# EAGLE design house rev2 (EAGLE 7.2.0)
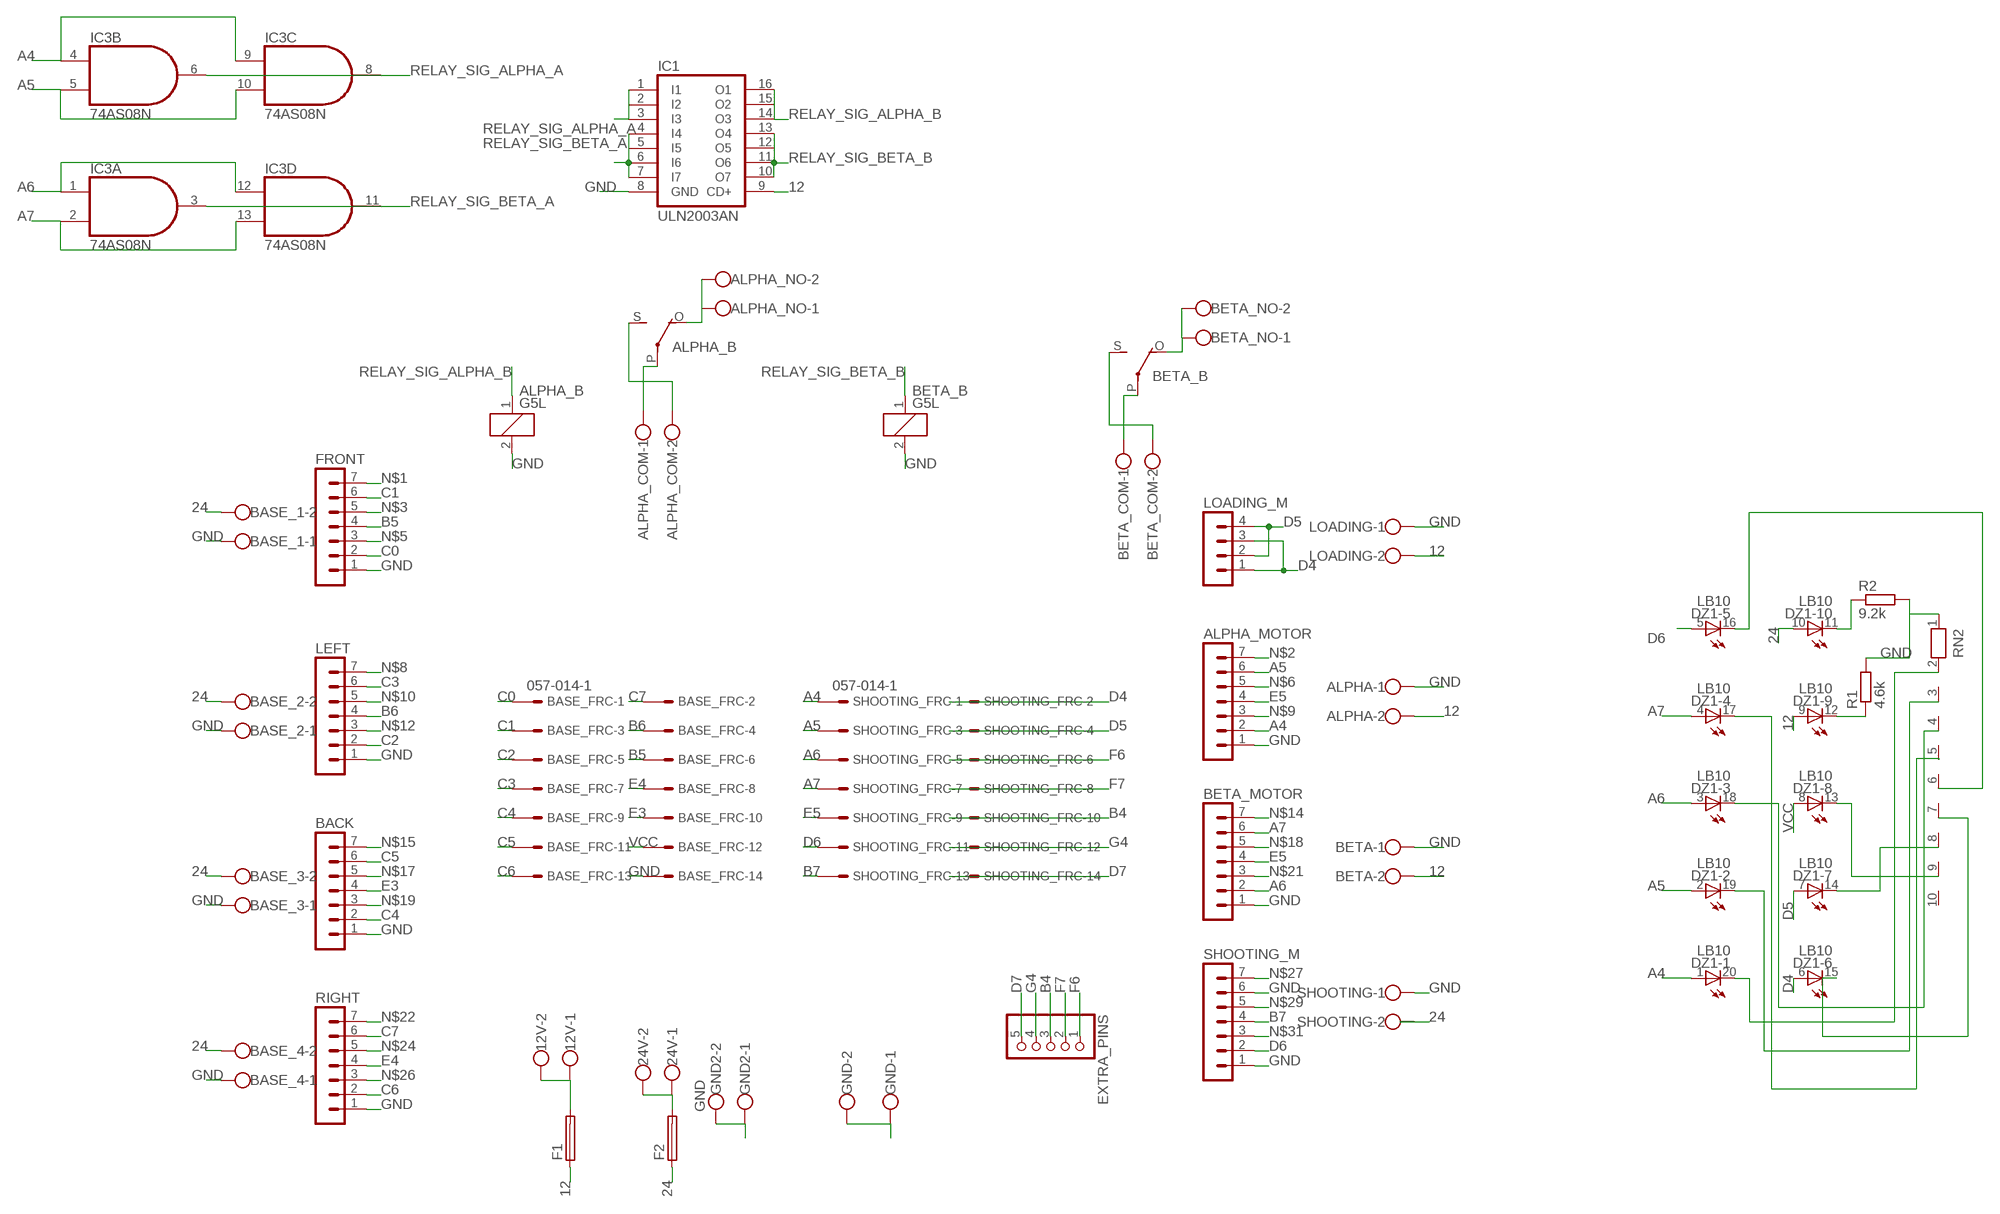
[diagram p0: schematic, sheet 1]

## Parts
12V  W237-102  [W237-102]
24V  W237-102  [W237-102]
ALPHA  W237-102  [W237-102]
ALPHA_B  G5L  [G5LE]
ALPHA_COM  W237-102  [W237-102]
ALPHA_MOTOR  MA07-1  [MA07-1]
ALPHA_NO  W237-102  [W237-102]
BACK  MA07-1  [MA07-1]
BASE_1  W237-102  [W237-102]
BASE_2  W237-102  [W237-102]
BASE_3  W237-102  [W237-102]
BASE_4  W237-102  [W237-102]
BASE_FRC  057-014-1  [057-014-1]
BETA  W237-102  [W237-102]
BETA_B  G5L  [G5LE]
BETA_COM  W237-102  [W237-102]
BETA_MOTOR  MA07-1  [MA07-1]
BETA_NO  W237-102  [W237-102]
DZ1  LB10  [LB10]
EXTRA_PINS  PINHD-1X5  [1X05]
F1  SH25  [SH25]
F2  SH25  [SH25]
FRONT  MA07-1  [MA07-1]
GND  W237-102  [W237-102]
GND2  GND  W237-102  [W237-102]
IC1  ULN2003AN  [DIL16]
IC3  74AS08N  [DIL14]
LEFT  MA07-1  [MA07-1]
LOADING  W237-102  [W237-102]
LOADING_M  MA04-1  [MA04-1]
R1  4.6k  R-EU_0204/7  [0204/7]
R2  9.2k  R-EU_0204/7  [0204/7]
RIGHT  MA07-1  [MA07-1]
RN2  RN09  [RN-10]
SHOOTING  W237-102  [W237-102]
SHOOTING_FRC  057-014-1  [057-014-1]
SHOOTING_M  MA07-1  [MA07-1]

## Nets
12: ALPHA.2 BETA.2 DZ1.9(-9:A) F1.1 IC1.9(CD+) LOADING.2
24: BASE_1.2 BASE_2.2 BASE_3.2 BASE_4.2 DZ1.10(-10:A) F2.1 SHOOTING.2
A4: ALPHA_MOTOR.2 DZ1.1(-1:A) IC3.4(B:I0) IC3.9(C:I0) SHOOTING_FRC.1
A5: ALPHA_MOTOR.6 DZ1.2(-2:A) IC3.5(B:I1) IC3.10(C:I1) SHOOTING_FRC.3
A6: BETA_MOTOR.2 DZ1.3(-3:A) IC3.1(A:I0) IC3.12(D:I0) SHOOTING_FRC.5
A7: BETA_MOTOR.6 DZ1.4(-4:A) IC3.2(A:I1) IC3.13(D:I1) SHOOTING_FRC.7
B4: EXTRA_PINS.3 SHOOTING_FRC.10
B5: BASE_FRC.6 FRONT.4
B6: BASE_FRC.4 LEFT.4
B7: SHOOTING_FRC.13 SHOOTING_M.4
C0: BASE_FRC.1 FRONT.2
C1: BASE_FRC.3 FRONT.6
C2: BASE_FRC.5 LEFT.2
C3: BASE_FRC.7 LEFT.6
C4: BACK.2 BASE_FRC.9
C5: BACK.6 BASE_FRC.11
C6: BASE_FRC.13 RIGHT.2
C7: BASE_FRC.2 RIGHT.6
D4: DZ1.6(-6:A) LOADING_M.1 LOADING_M.3 SHOOTING_FRC.2
D5: DZ1.7(-7:A) LOADING_M.2 LOADING_M.4 SHOOTING_FRC.4
D6: DZ1.5(-5:A) SHOOTING_FRC.11 SHOOTING_M.2
D7: EXTRA_PINS.5 SHOOTING_FRC.14
E3: BACK.4 BASE_FRC.10
E4: BASE_FRC.8 RIGHT.4
E5: ALPHA_MOTOR.4 BETA_MOTOR.4 SHOOTING_FRC.9
F6: EXTRA_PINS.1 SHOOTING_FRC.6
F7: EXTRA_PINS.2 SHOOTING_FRC.8
G4: EXTRA_PINS.4 SHOOTING_FRC.12
GND: ALPHA.1 ALPHA_B.2 ALPHA_MOTOR.1 BACK.1 BASE_1.1 BASE_2.1 BASE_3.1 BASE_4.1 BASE_FRC.14 BETA.1 BETA_B.2 BETA_MOTOR.1 FRONT.1 GND2.1 GND2.2 GND.1 GND.2 IC1.8(GND) LEFT.1 LOADING.1 R1.2 R2.2 RIGHT.1 RN2.1 SHOOTING.1 SHOOTING_M.1 SHOOTING_M.6
N$1: FRONT.7
N$2: ALPHA_MOTOR.7
N$3: FRONT.5
N$4: DZ1.20(-1:C) RN2.2
N$5: FRONT.3
N$6: ALPHA_MOTOR.5
N$7: DZ1.19(-2:C) RN2.3
N$8: LEFT.7
N$9: ALPHA_MOTOR.3
N$10: LEFT.5
N$11: DZ1.18(-3:C) RN2.4
N$12: LEFT.3
N$13: DZ1.17(-4:C) RN2.5
N$14: BETA_MOTOR.7
N$15: BACK.7
N$16: DZ1.16(-5:C) RN2.6
N$17: BACK.5
N$18: BETA_MOTOR.5
N$19: BACK.3
N$20: DZ1.15(-6:C) RN2.7
N$21: BETA_MOTOR.3
N$22: RIGHT.7
N$23: BETA_B.P(2:P) BETA_COM.1
N$24: RIGHT.5
N$25: DZ1.14(-7:C) RN2.8
N$26: RIGHT.3
N$27: SHOOTING_M.7
N$28: DZ1.13(-8:C) RN2.9
N$29: SHOOTING_M.5
N$30: DZ1.12(-9:C) R1.1
N$31: SHOOTING_M.3
N$32: DZ1.11(-10:C) R2.1
N$33: BETA_B.S(2:S) BETA_COM.2
N$34: ALPHA_B.S(2:S) ALPHA_COM.2
N$35: ALPHA_B.P(2:P) ALPHA_COM.1
N$36: ALPHA_B.O(2:O) ALPHA_NO.1 ALPHA_NO.2
N$37: BETA_B.O(2:O) BETA_NO.1 BETA_NO.2
N$38: 24V.1 24V.2 F2.2
N$39: 12V.1 12V.2 F1.2
RELAY_SIG_ALPHA_A: IC1.1(I1) IC1.2(I2) IC1.3(I3) IC3.6(B:O) IC3.8(C:O)
RELAY_SIG_ALPHA_B: ALPHA_B.1 IC1.14(O3) IC1.15(O2) IC1.16(O1)
RELAY_SIG_BETA_A: IC1.4(I4) IC1.5(I5) IC1.6(I6) IC1.7(I7) IC3.3(A:O) IC3.11(D:O)
RELAY_SIG_BETA_B: BETA_B.1 IC1.10(O7) IC1.11(O6) IC1.12(O5) IC1.13(O4)
VCC: BASE_FRC.12 DZ1.8(-8:A)
Unconnected: RN2.10

## Power pins joined to a net without a drawn wire
GND: IC3.7(P:GND)
VCC: IC3.14(P:VCC)

## Library data of the parts
12V 24V ALPHA ALPHA_COM ALPHA_NO BASE_1-BASE_4 BETA BETA_COM BETA_NO GND GND2 LOADING SHOOTING = con-wago-500:W237-102: WAGO SCREW CLAMP; MPN: 237-102; OC_FARNELL: unknown; OC_NEWARK: 70K9898
ALPHA_B BETA_B = relay:G5L: RELAY 1 x switch, 10 A/120 V AC, 8 A/30 V ADC, Omron; OC_FARNELL: unknown; OC_NEWARK: unknown
ALPHA_MOTOR BACK BETA_MOTOR FRONT LEFT RIGHT SHOOTING_M = con-lstb:MA07-1: PIN HEADER; OC_FARNELL: unknown; OC_NEWARK: unknown
BASE_FRC SHOOTING_FRC = con-panduit:057-014-: CONNECTOR 10-pin series 057 contact pc board low profile headers; OC_FARNELL: unknown; OC_NEWARK: unknown
DZ1 = led:LB10: LED BLOCK 10-LED bar graph, DIL, Siemens
EXTRA_PINS = pinhead:PINHD-1X5: PIN HEADER
F1 F2 = fuse:SH25: FUSE HOLDER grid 25 mm, OGN0031 8211, Schurter (Buerklin); MF: SCHURTER; MPN: 0031.8211; OC_FARNELL: 1162741; OC_NEWARK: 96B9380
IC1 = uln-udn:ULN2003A: DRIVER ARRAY
IC3 = 74xx-us:74*08: Quad 2-input AND gate
LOADING_M = con-lstb:MA04-1: PIN HEADER; OC_FARNELL: unknown; OC_NEWARK: unknown
R1 R2 = resistor:R-EU_: RESISTOR, European symbol
RN2 = resistor-net:RN09: RESISTOR NETWORK; OC_FARNELL: unknown; OC_NEWARK: unknown

## Board
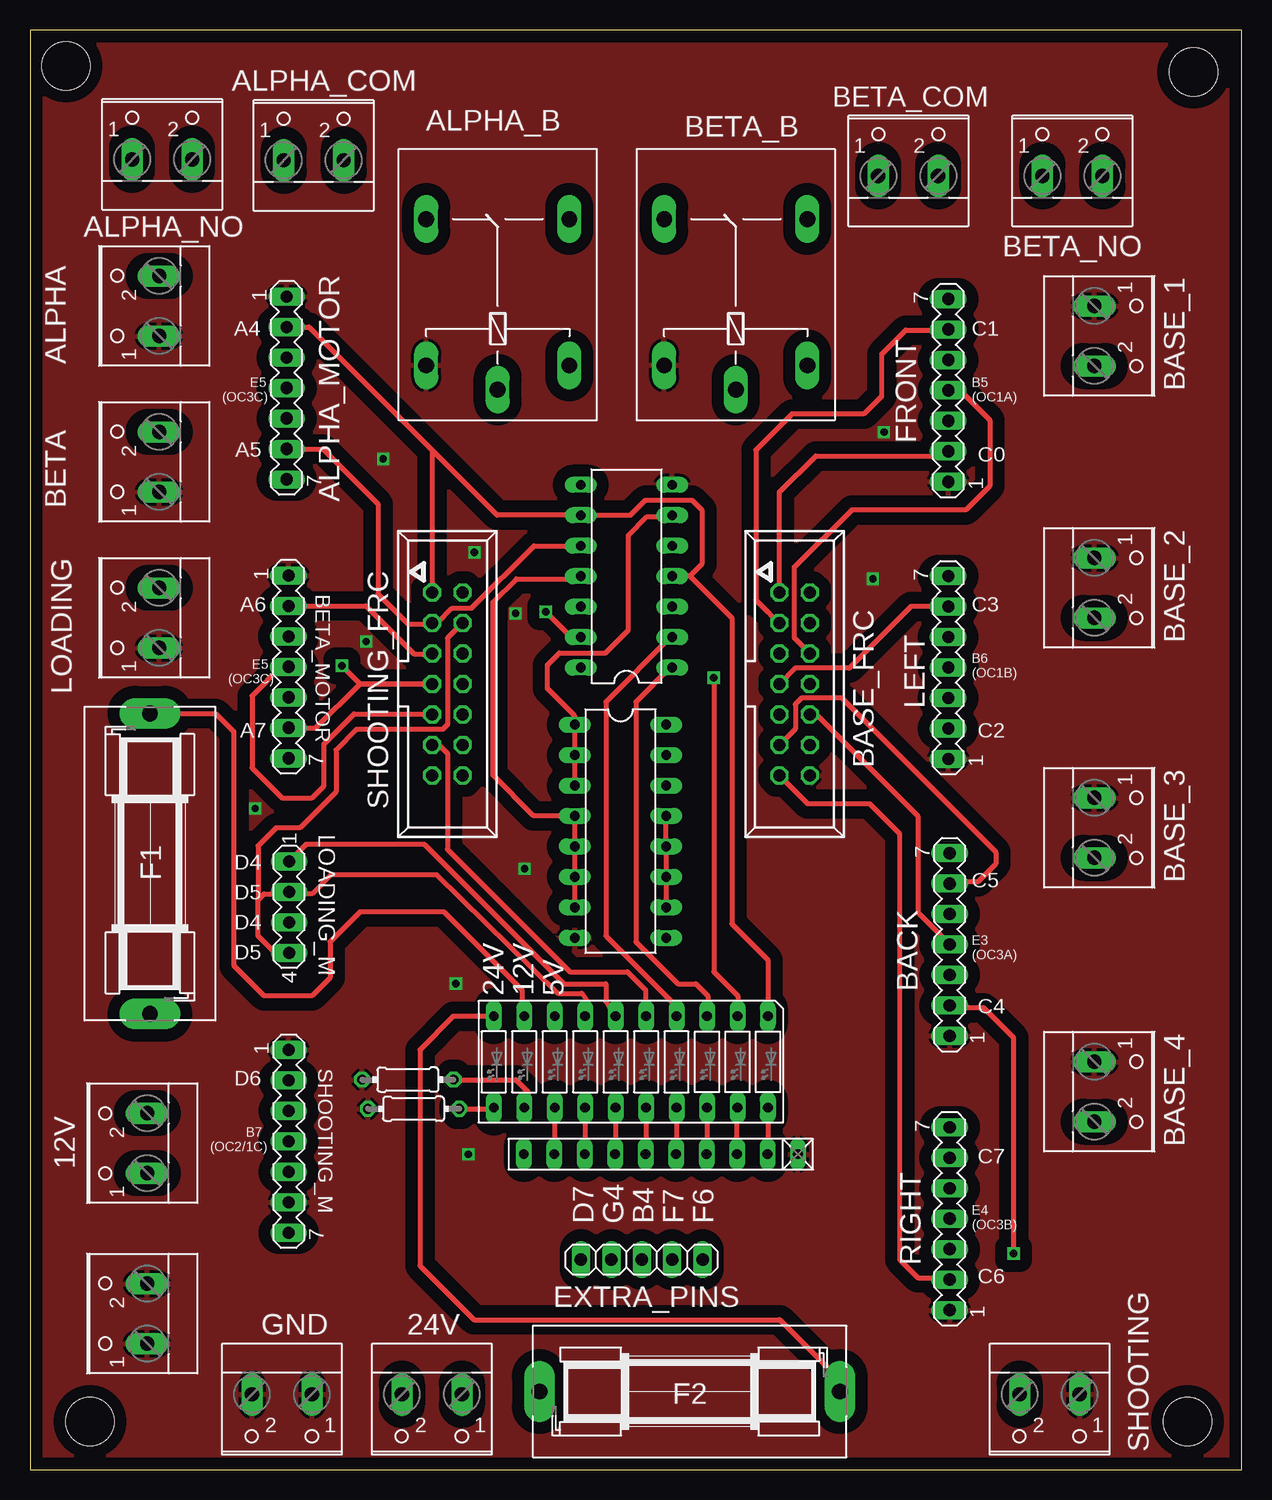
[diagram p1: board, top side]
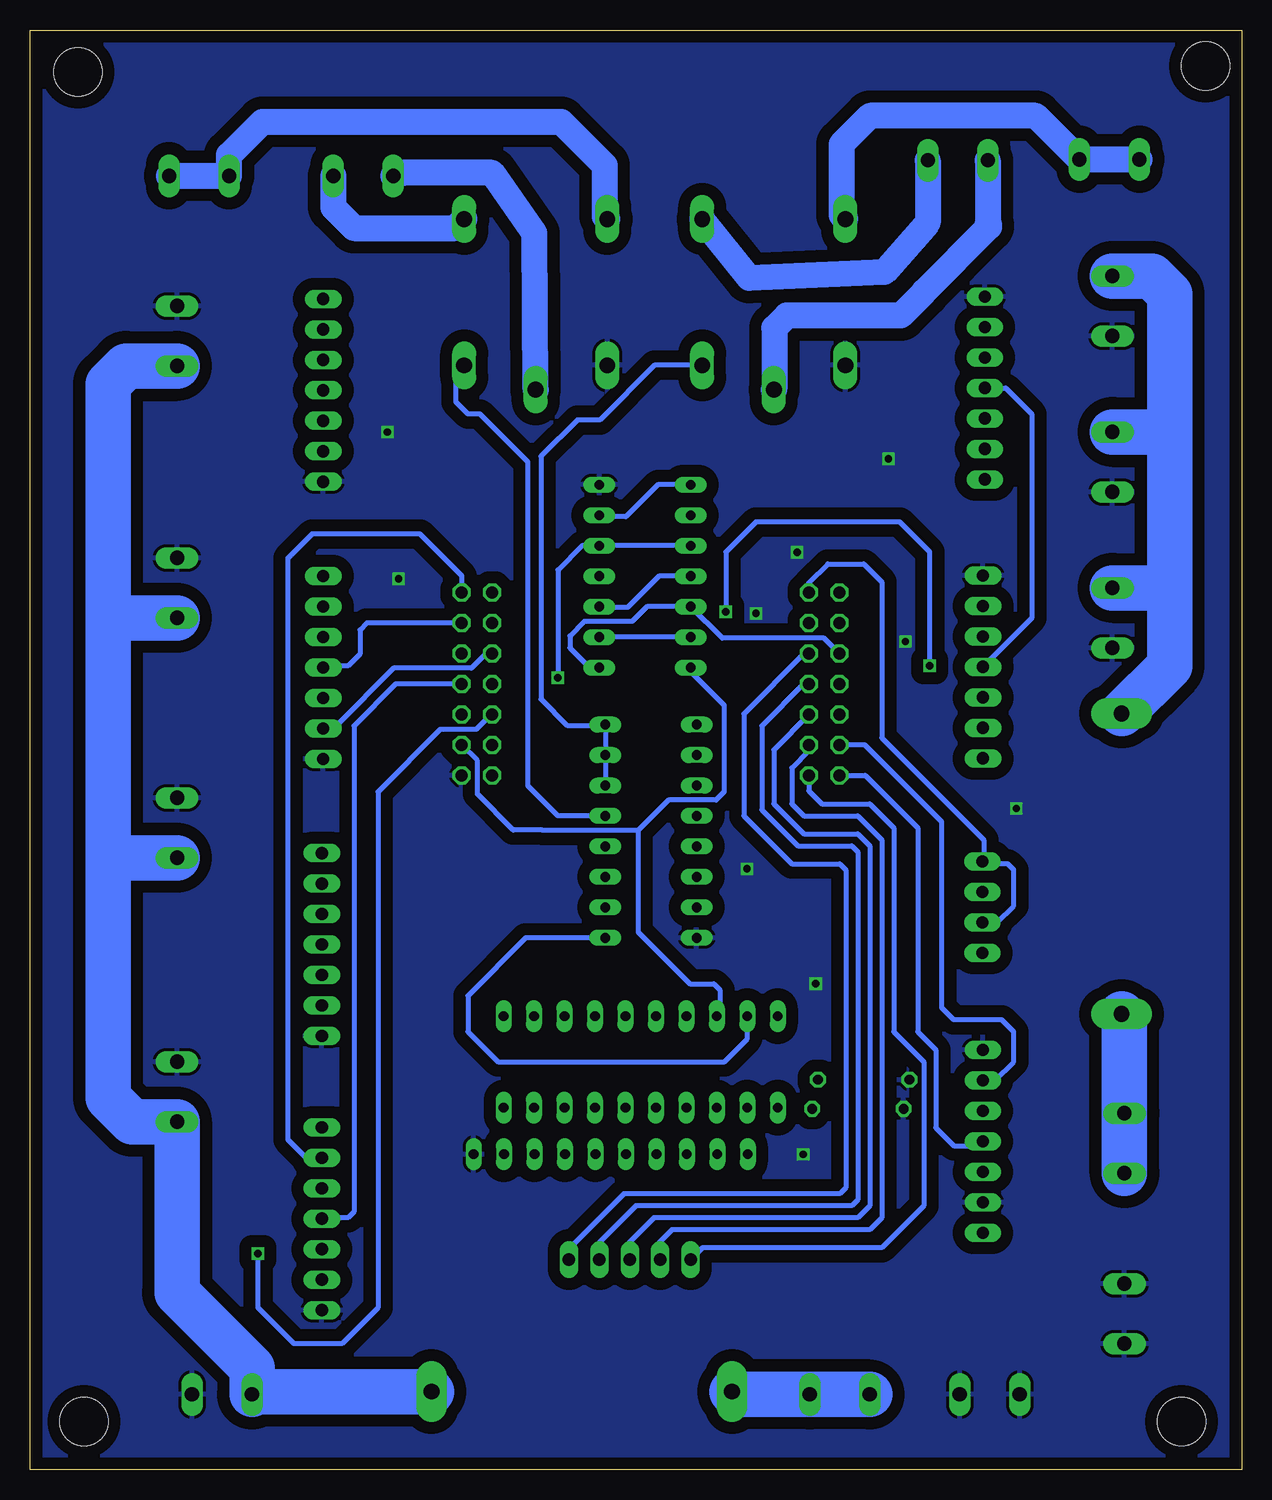
[diagram p2: board, bottom side, seen from below]

Size 101 x 120 mm. Coordinates in mm from the lower left corner, seen from the top.
Outline: 0,0 101,0 101,120 0,120 0,0
Copper layers (1*16): Top 0.035mm / dielectric 1.5mm / Bottom 0.035mm
Design rules "default": minimum track width 10mil, minimum drill 24mil, track to track 8mil, track to pad 8mil, pad to pad 8mil, via to via 8mil, smd to smd 8mil, copper to edge 40mil, drill to drill 8mil, minimum pad ring 10mil, minimum via ring 8mil, stop-mask expansion 4mil, vias tented up to drill 0mil, thermal gap 10mil
Holes 4 mm at 3,117 97,116.5 96.5,4 5,4

### Footprints (pad centres in the part's own frame; a part is rotated, then mirrored left to right if it is on the bottom)
W237-102 = drill 1.194 long: 1 -2.5,-1.27; 2 2.5,-1.27
G5LE = drill 1.321 long: 1 -7.493,-5.969; 2 -7.493,5.969; O 4.699,5.969; P -9.525,0; S 4.699,-5.969
MA07-1 = drill 1.016 long: 1 -7.62,0; 2 -5.08,0; 3 -2.54,0; 4 0,0; 5 2.54,0; 6 5.08,0; 7 7.62,0
057-014-1 = drill 1 octagon: 1 -7.62,-1.27; 2 -7.62,1.27; 3 -5.08,-1.27; 4 -5.08,1.27; 5 -2.54,-1.27; 6 -2.54,1.27; 7 0,-1.27; 8 0,1.27; 9 2.54,-1.27; 10 2.54,1.27; 11 5.08,-1.27; 12 5.08,1.27; 13 7.62,-1.27; 14 7.62,1.27
LB10 = drill 0.813 long: 1 -11.43,-3.81; 2 -8.89,-3.81; 3 -6.35,-3.81; 4 -3.81,-3.81; 5 -1.27,-3.81; 6 1.27,-3.81; 7 3.81,-3.81; 8 6.35,-3.81; 9 8.89,-3.81; 10 11.43,-3.81; 11 11.43,3.81; 12 8.89,3.81; 13 6.35,3.81; 14 3.81,3.81; 15 1.27,3.81; 16 -1.27,3.81; 17 -3.81,3.81; 18 -6.35,3.81; 19 -8.89,3.81; 20 -11.43,3.81
1X05 = drill 1.016 long: 1 -5.08,0; 2 -2.54,0; 3 0,0; 4 2.54,0; 5 5.08,0
SH25 = drill 1.321 pad 2.54 long: 1 -12.522,0; 2 12.522,0
DIL16 = drill 0.813 long: 1 -8.89,-3.81; 2 -6.35,-3.81; 3 -3.81,-3.81; 4 -1.27,-3.81; 5 1.27,-3.81; 6 3.81,-3.81; 7 6.35,-3.81; 8 8.89,-3.81; 9 8.89,3.81; 10 6.35,3.81; 11 3.81,3.81; 12 1.27,3.81; 13 -1.27,3.81; 14 -3.81,3.81; 15 -6.35,3.81; 16 -8.89,3.81
DIL14 = drill 0.813 long: 1 -7.62,-3.81; 2 -5.08,-3.81; 3 -2.54,-3.81; 4 0,-3.81; 5 2.54,-3.81; 6 5.08,-3.81; 7 7.62,-3.81; 8 7.62,3.81; 9 5.08,3.81; 10 2.54,3.81; 11 0,3.81; 12 -2.54,3.81; 13 -5.08,3.81; 14 -7.62,3.81
MA04-1 = drill 1.016 long: 1 -3.81,0; 2 -1.27,0; 3 1.27,0; 4 3.81,0
0204/7 = drill 0.813 octagon: 1 -3.81,0; 2 3.81,0
RN-10 = drill 0.813 long: 1 -11.43,0; 2 -8.89,0; 3 -6.35,0; 4 -3.81,0; 5 -1.27,0; 6 1.27,0; 7 3.81,0; 8 6.35,0; 9 8.89,0; 10 11.43,0

### Placement (x,y rotation side)
12V  8.5,27.2 90 top
24V  33.5,5 180 top
ALPHA  9.5,97 90 top
ALPHA_B  38.99,99.54 90 top
ALPHA_COM  23.65,110.41 0 top
ALPHA_MOTOR  21.39,90.16 270 top
ALPHA_NO  11.02,110.49 0 top
BACK  76.67,43.76 90 top
BASE_1  90,94.5 270 top
BASE_2  90,73.5 270 top
BASE_3  90,53.5 270 top
BASE_4  90,31.5 270 top
BASE_FRC  63.74,65.49 270 top
BETA  9.5,84 90 top
BETA_B  58.84,99.54 90 top
BETA_COM  73.22,109.11 0 top
BETA_MOTOR  21.55,66.91 270 top
BETA_NO  86.9,109.11 0 top
DZ1  50.09,33.98 180 top
EXTRA_PINS  51,17.5 180 top
F1  10,50.5 270 top
F2  55,6.5 180 top
FRONT  76.55,89.96 90 top
GND  21,5 180 top
GND2  8.5,13 90 top
IC1  49.23,53.21 270 top
IC3  49.73,74.47 90 top
LEFT  76.55,66.86 90 top
LOADING  9.5,71 90 top
LOADING_M  21.6,46.88 270 top
R1  31.5,32.5 180 top
R2  31.98,30.07 180 top
RIGHT  76.67,20.91 90 top
RN2  52.59,26.29 180 top
SHOOTING  85,5 180 top
SHOOTING_FRC  34.8,65.49 270 top
SHOOTING_M  21.57,27.36 270 top

### Tracks (layer width: path | path; a pad name or v marks a point on that pad's centre or on a via)
12
  Top 0.406: F1.1 15.48,63.02 17,61.5 17,42 19.5,39.5 23.5,39.5 25,41 25,44 27.5,46.5 34.5,46.5 41,40 41,37.99 DZ1.9
  Bottom 0.406: IC1.9 59.68,44.32 64.5,39.5 64.5,36.5 62,34 43.1,34 41.2,35.9 DZ1.9
  Bottom 3.81: F1.1 9.98,63.02 6,67 6,73.5 | 6,73.5 6,87.5 | 6,87.5 6,98 7.5,99.5 ALPHA.2 | BETA.2 7,86.5 6,87.5 | LOADING.2 6,73.5
24
  Top 0.406: DZ1.10 35.29,37.79 32.5,35 32.5,17 37,12.5 62.5,12.5 67.52,7.48 F2.1
  Bottom 0.406: 67.52,7.48 F2.1
  Bottom 3.81: 94.5,51 94.5,31 92.5,29 BASE_4.2 88.73,14.73 82.5,8.5 SHOOTING.2 82.27,6.5 F2.1 | 94.5,51 94.5,71 | 94.5,71 94.5,90.5 93,92 BASE_1.2 | BASE_3.2 94.5,51 | BASE_2.2 94.5,71
A4
  Top 0.406: ALPHA_MOTOR.2 23.26,95.24 33.5,85 | 33.5,85 33.5,73.14 SHOOTING_FRC.1 | 55,74.5 56,75.5 56,80 55.2,80.8 51.3,80.8 50.05,79.55 IC3.9 38.95,79.55 33.5,85 | 55,74.5 53.57,74.5 IC3.4 | 55,74.5 58.5,71 58.5,45.5 61.5,42.5 61.5,37.81 DZ1.1
A5  (via drill 0.6)
  Top 0.406: ALPHA_MOTOR.6 24.42,85.08 29,80.5 29,73 31.5,70.5 33.46,70.5 SHOOTING_FRC.3 33.97,70.57 35.2,71.8 36.8,71.8 42,77 45.91,77 IC3.10 | v57,66 57,41.5 59,39.5 59,37.81 DZ1.2
  Bottom 0.406: IC3.10 IC3.5 54.99,77.01 57,75 v57,66
A6
  Top 0.406: BETA_MOTOR.2 28.01,71.99 32,68 33.5,68 SHOOTING_FRC.5 | IC3.1 53.35,66.85 50.5,64 50.5,44 54,40.5 55.5,40.5 56.5,39.5 56.5,37.85 DZ1.3
  Bottom 0.406: IC3.1 53.69,67 54.5,67 56,68.5 56,69.5 54.8,70.7 50.8,70.7 49.57,71.93 IC3.12 43.29,69.3 34.8,69.3 SHOOTING_FRC.5
A7  (via drill 0.6)
  Top 0.406: BETA_MOTOR.6 23.83,61.83 27.5,65.5 SHOOTING_FRC.7 27.51,65.49 v26,67 | v43,71.5 45,69.5 45.81,69.5 IC3.13 | IC3.2 53.39,69.39 48,64 48,44.5 54,38.5 54,37.89 DZ1.4
  Bottom 0.406: IC3.13 IC3.2 | v26,67 26,76.5 28.5,79 40.5,79 43,76.5 v43,71.5
B4
  Bottom 0.406: SHOOTING_FRC.10 36.07,62.93 39,60 39,55.5 36.5,53 32,53 31,52 31,22 32,21 49,21 51,19 EXTRA_PINS.3
B5
  Top 0.406: BASE_FRC.6 63.7,69.34 63.7,75.2 68.5,80 78,80 80,82 80,87.5 77.54,89.96 FRONT.4
B6
  Bottom 0.406: BASE_FRC.4 72.93,70.57 73.5,70 73.5,68 74.5,67 76.41,67 LEFT.4
B7
  Bottom 0.406: SHOOTING_FRC.13 31.37,57.87 27,53.5 27,36.5 25.5,35 25.5,28.5 24,27 21.93,27 SHOOTING_M.4
C0
  Top 0.406: BASE_FRC.1 62.47,81.47 65.5,84.5 76.17,84.5 FRONT.2
C1
  Top 0.406: BASE_FRC.3 62.4,70.5 61.5,71.5 60.5,72.5 60.5,85 63.5,88 69.5,88 71,89.5 71,93 73,95 76.51,95 FRONT.6
C2
  Bottom 0.406: BASE_FRC.5 62.97,68.03 64.2,66.8 70.7,66.8 75.5,62 76.33,62 LEFT.2
C3
  Top 0.406: LEFT.6 73.44,71.94 68.3,66.8 63.78,66.8 BASE_FRC.7
C4  (via drill 0.6)
  Top 0.406: v82,18 82,36 79.5,38.5 76.85,38.5 BACK.2
  Bottom 0.406: BASE_FRC.9 62.55,62.95 63.8,61.7 66.8,61.7 72,56.5 72,13.5 75,10.5 79,10.5 82,13.5 v82,18
C5
  Top 0.406: BASE_FRC.11 63.8,61.74 63.8,63.8 64.3,64.3 67.7,64.3 80.5,51.5 80.5,50.5 79,49 76.83,49 BACK.6
C6
  Top 0.406: BASE_FRC.13 64.84,55.5 70,55.5 72.5,53 72.5,17.5 74,16 76.5,16 RIGHT.2
C7
  Bottom 0.406: 77.99,25.99 RIGHT.6 78,26 79.5,27.5 79.5,76 79.25,76.25 77.5,78 68.5,78 65,74.5 BASE_FRC.2
D4
  Top 0.406: DZ1.6 48.5,38.11 48,39 48,40.5 44.5,40.5 32.89,52.11 23.02,52.11 LOADING_M.1
  Bottom 0.406: SHOOTING_FRC.2 36.07,73.93 34.5,75.5 31.5,75.5 30,74 30,61 21.5,52.5 21.5,50.79 LOADING_M.1 21.41,50.5 19.5,50.5 19,50 19,47 20.39,45.61 LOADING_M.3
D5
  Top 0.406: DZ1.7 46.5,38.01 46.5,39 46,39.7 44,39.7 33.93,49.57 25.07,49.57 23.5,48 21.75,48 LOADING_M.2 21.45,48 19.5,48 19,47.5 | LOADING_M.4 20.43,43.07 19,44.5 19,47.5 | SHOOTING_FRC.4 34.8,69.3 34.8,62.1 34.4,61.7 27.2,61.7 25.5,60 25.5,56.5 22.5,53.5 20.5,53.5 19,52 19,47.5
D6
  Top 0.406: SHOOTING_FRC.11 34.09,60.41 34.8,59.7 34.8,51.7 45,41.5 49.8,41.5 51.3,40 51.3,37.85 DZ1.5
  Bottom 0.406: SHOOTING_FRC.11 31.41,60.41 25,54 25,38.5 24,37.5 20,37.5 19,36.5 19,34 20.56,32.44 SHOOTING_M.2
D7
  Bottom 0.406: SHOOTING_FRC.14 36.07,56.57 35,55.5 31,55.5 29,53.5 29,36.5 26.5,34 26.5,22 30,18.5 44.92,18.5 EXTRA_PINS.5
E3
  Top 0.406: BASE_FRC.10 65.55,62.95 74,54.5 74,46.43 BACK.4
E4
  Bottom 0.406: BASE_FRC.8 70.51,65.49 74,62 74,21.5 74.5,21 76.58,21 RIGHT.4
E5
  Top 0.406: BETA_MOTOR.4 20.91,66.91 18.5,64.5 18.5,58.5 21,56 23.5,56 24.5,57 24.5,60.5 27,63 33.48,63 SHOOTING_FRC.9
  Bottom 0.406: ALPHA_MOTOR.4 19.66,90.16 17.5,88 17.5,70.96 BETA_MOTOR.4
F6
  Bottom 0.406: SHOOTING_FRC.6 36.47,68.03 41.5,63 41.5,54.5 37.5,50.5 33.5,50.5 33,50 33,23.5 33.5,23 51.5,23 56,18.5 56,17.58 EXTRA_PINS.1
F7
  Bottom 0.406: SHOOTING_FRC.8 36.51,65.49 40,62 40,55 37,52 32.5,52 32,51.5 32,22.5 32.5,22 50.5,22 53.5,19 53.5,17.54 EXTRA_PINS.2
G4
  Bottom 0.406: SHOOTING_FRC.12 36.07,59.93 37.5,58.5 37.5,55.5 36.5,54.5 32,54.5 30,52.5 30,21 31,20 47.5,20 48.5,19 48.5,17.54 EXTRA_PINS.4
GND  (via drill 0.6)
  other vias: 35.5,40.5 29.43,84.25 18.76,55.1 71.2,86.48 41.23,50.08 37.05,76.46 40.47,71.37 70.27,74.25 36.54,26.27 28.01,69.02
  pour Bottom (isolate 1.016): 0,120 101,120 101,0 0,0
  pour Top (isolate 1.016): 0,120 101,120 101,0 0,0
N$4
  Top 0.406: DZ1.20 61.52,26.33 RN2.2
N$7
  Top 0.406: RN2.3 58.94,30.13 DZ1.19
N$11
  Top 0.406: DZ1.18 56.44,26.33 RN2.4
N$13
  Top 0.406: DZ1.17 53.9,26.33 RN2.5
N$16
  Top 0.406: DZ1.16 51.36,26.33 RN2.6
N$20
  Top 0.406: DZ1.15 48.82,26.33 RN2.7
N$23
  Bottom 2.184: BETA_B.P 58.94,103.04 62.5,108.1 69.88,108.1 BETA_COM.1
N$25
  Top 0.406: DZ1.14 46.28,26.33 RN2.8
N$28
  Top 0.406: DZ1.13 43.74,26.33 RN2.9
N$30
  Top 0.406: R1.1 40.5,32.5 41.5,31.5 41.5,30.47 DZ1.12
N$32
  Top 0.406: R2.1 38.56,30.07 DZ1.11
N$33
  Bottom 2.184: BETA_COM.2 75.72,105.22 74,103.5 65.55,103.5 BETA_B.S
N$34
  Bottom 2.184: ALPHA_COM.2 26.15,103.94 29.77,99.82 41.04,99.32 ALPHA_B.S
N$35
  Bottom 2.184: ALPHA_COM.1 21.15,103.83 21.05,103.73 21.05,103.59 26.45,98.19 26.45,98.15 28.4,96.2 37.91,96.2 38.96,95.16 38.96,90.05 ALPHA_B.P
N$36
  Bottom 2.184: ALPHA_B.O 33.35,104.57 33.35,110.46 30.97,112.85 17.15,112.85 ALPHA_NO.2 ALPHA_NO.1
N$37
  Bottom 2.184: BETA_NO.2 BETA_NO.1 84.4,109.57 81.62,112.35 56.73,112.35 53.1,108.72 53.1,104.47 BETA_B.O
N$38
  Bottom 3.81: 24V.2 24V.1 42.25,6.27 F2.2
N$39
  Bottom 3.81: 12V.1 12V.2 9.77,37.75 F1.2
RELAY_SIG_ALPHA_A
  Top 0.406: IC1.3 IC1.2 IC1.1 45.42,62.81 43.13,65.09 43.13,67.07 43.96,67.9 43.96,67.91 44.12,68.07 47.98,68.07 49.89,69.97 49.89,77.86 51.45,79.43 53.42,79.43 IC3.6
  Bottom 0.406: IC3.8 48.65,82.09 51.31,79.43 53.42,79.43 IC3.6
RELAY_SIG_ALPHA_B
  Bottom 0.406: IC1.14 IC1.15 IC1.16 53.11,62.03 56.23,62.03 58.41,64.22 58.41,84.46 55.37,87.5 53.5,87.5 48.95,92.05 ALPHA_B.1
RELAY_SIG_BETA_A
  Top 0.406: IC1.7 IC1.6 IC1.5 IC1.4 41.99,54.48 38.59,57.88 38.59,72.3 40.55,74.25 45.7,74.25 IC3.11
  Bottom 0.406: IC3.11 48.56,74.47 51.18,71.86 53.47,71.86 IC3.3
RELAY_SIG_BETA_B
  Top 0.406: IC1.12 53.04,51.54 53,51.5 53,51.9 IC1.12 | IC1.12 IC1.11 IC1.10 | IC1.12 IC1.13
  Bottom 0.406: BETA_B.1 65.5,91.36 65.5,89 64.5,88 63.5,88 59.5,84 59.5,57 56.98,54.48 IC1.13
VCC
  Bottom 0.406: IC3.14 45.92,66.5 43.13,63.72 43.13,56.54 43.14,56.54 43.14,56.49 43.77,55.86 43.77,55.84 43.81,55.8 47.79,55.8 50.15,53.44 50.3,53.29 | 50.3,53.29 58.26,53.29 58.29,53.31 60.71,53.31 63.7,56.3 63.7,59.1 BASE_FRC.12 | 50.3,53.29 50.3,44.8 46,40.5 44,40.5 43.5,40 43.5,38.03 DZ1.8

### Text on the board
tNames: A4 | C1 | E5 / (OC3C) | B5 / (OC1A) | A5 | C0 | A6 | C3 | B6 / (OC1B) | E5 / (OC3C) | A7 | C2 | D4 | C5 | D5 | D4 | D5 | E3 / (OC3A) | 24V | 12V | 5V | C4 | D6 | B7 / (OC2/1C) | C7 | D7 | G4 | B4 | F7 | F6 | E4 / (OC3B) | C6
tValues: Society of Robotics and Automation | Robocon 2017